# Altium schematic sheet USBDM_SWD_SER_JS16CWJ.SchDoc: USBDM_JS16CWJ_V2
size A4; Revision: 3.4
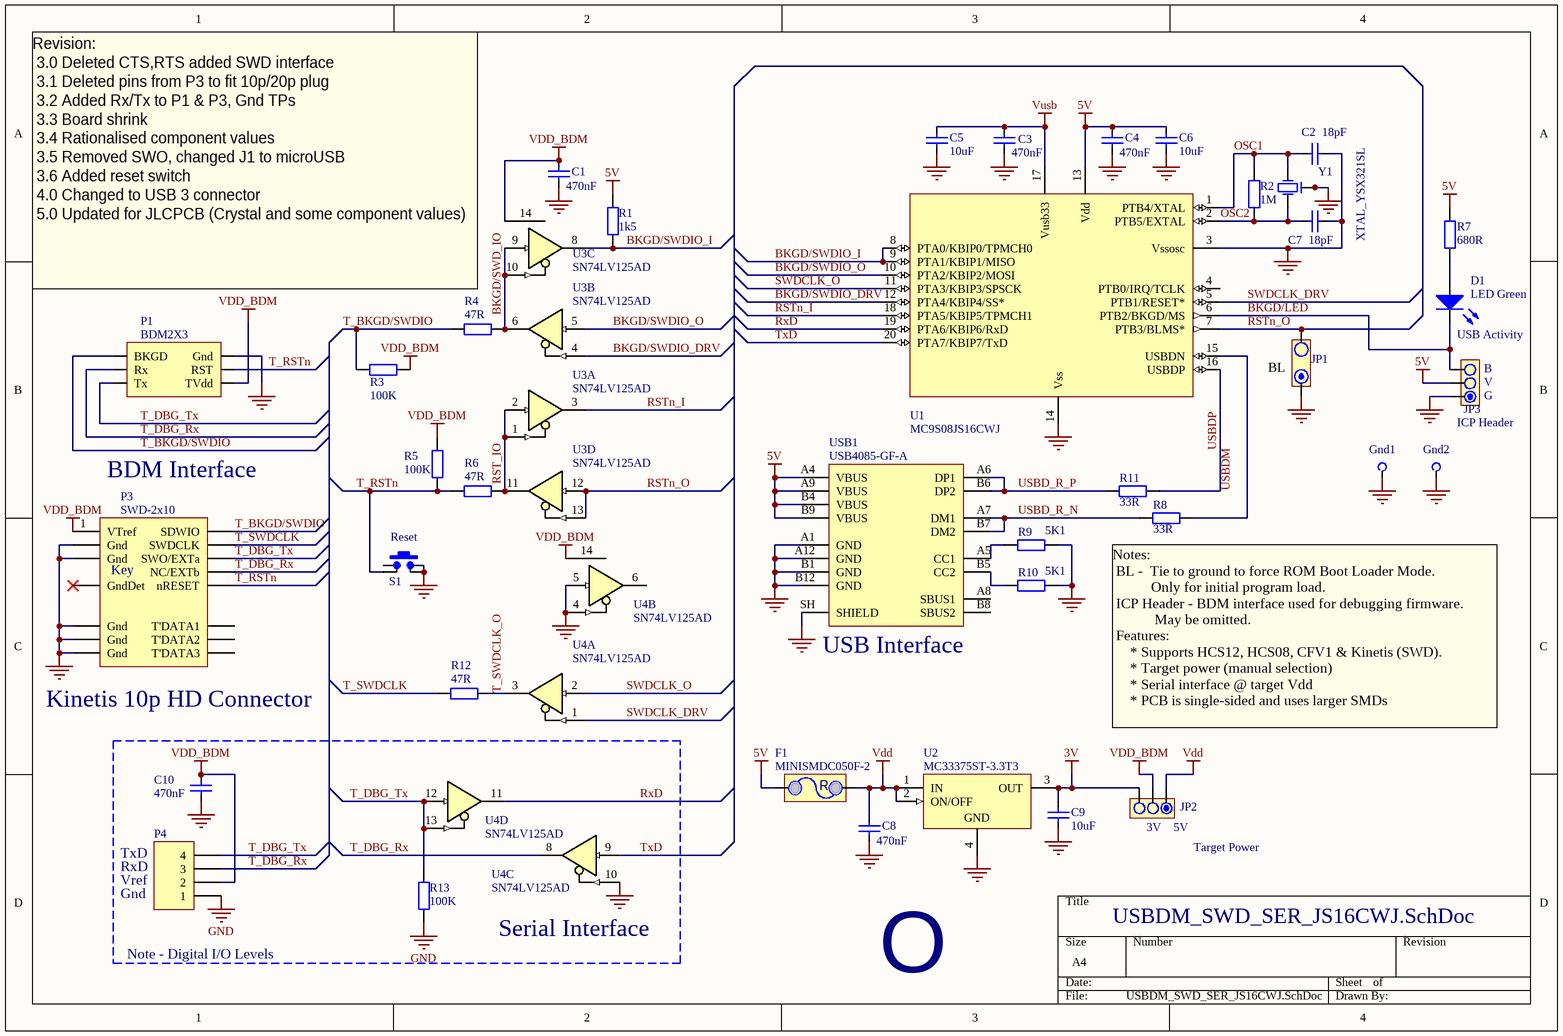
[diagram p0: USBDM_SWD_SER_JS16CWJ.SchDoc]

## Parts
C1  470nF  [CCNP2012-0805]
C2  18pF  [CCNP1608-0603_N]
C3  470nF  [CCNP2012-0805]
C4  470nF  [CCNP2012-0805]
C5  10uF  [CCNP2012-0805]
C6  10uF  [CCNP2012-0805]
C7  18pF  [CCNP1608-0603_N]
C8  470nF  [CCNP2012-0805]
C9  10uF  [CCNP2012-0805]
C10  470nF  [CCNP2012-0805]
D1  LED Green  [LED2012-0805-GREEN]
F1  MINISMDC050F-2  [PTC4532-1812]
Gnd1  TP  [PCBPIN - 0.9mm]  (value not drawn)  (no BOM)
Gnd2  TP  [PCBPIN - 0.9mm]  (value not drawn)  (no BOM)
JP1  PIN2X1  [HDR1X2S]  (value not drawn)
JP2  PIN3X1  [HDR1X3S]  (value not drawn)  (no BOM)
JP3  PIN3X1  [HDR1X3S]  (value not drawn)  (no BOM)
Logo  OSHW Logo  [OSHW]  (value not drawn)  (no BOM)
P1  BDM2X3  [BDM]
P3  SWD-2x10  [SWD-2x10 - reduced]
P4  Serial  [HDR1X4S]  (value not drawn)
R1  1k5  [CR2012-0805]
R2  1M  [CR2012-0805]
R3  100K  [CR2012-0805]
R4  47R  [CR2012-0805]
R5  100K  [CR2012-0805]
R6  47R  [CR2012-0805]
R7  680R  [CR2012-0805]
R8  33R  [CR2012-0805]
R9  5K1  [CR2012-0805]
R10  5K1  [CR2012-0805]
R11  33R  [CR2012-0805]
R12  47R  [CR2012-0805]
R13  100K  [CR2012-0805]
S1  SMD-SW-4_5.1x5.1x2.0_M  [SMD-SW-4_5.1x5.1x2.0_M]  (value not drawn)
U1  MC9S08JS16CWJ  [SO-G20]
U2  MC33375ST-3.3T3  [SOT223]
U3  SN74LV125AD  [SO-14_M]  (parts A,B,C,D of 4)
U4  SN74LV125AD  [SO-14_M]  (parts A,B,C,D of 4)
USB1  USB4085-GF-A  [USB4085-GF-A]
Y1  XTAL_YSX321SL  [Crystal_SMT - YSX321SL]

## Blocks framed on the sheet
Serial Interface: C10 P4 R13 U4

## Nets
3V: C9.2 JP2.3 U2.3(OUT)
5V: C4.2 C6.2 F1.1 JP3.2 R1.2 R7.2 U1.13(Vdd) USB1.A4(VBUS) USB1.A9(VBUS) USB1.B4(VBUS) USB1.B9(VBUS)
GND: C1.1 C2.2 C3.1 C4.1 C5.1 C6.1 C7.2 C8.1 C9.1 C10.1 Gnd1.1(TP) Gnd2.1(TP) JP1.1 JP3.1 P1.2(Gnd) P3.3(Gnd) P3.5(Gnd) P3.15(Gnd) P3.17(Gnd) P3.19(Gnd) P4.1 R9.2 R10.2 R13.2 S1.1 S1.1b U1.3(Vssosc) U1.14(Vss) U2.4(GND) U3.7(Gnd) U4.4(oe2) U4.5(a2) U4.7(Gnd) U4.10(oe3) USB1.A1(GND) USB1.A12(GND) USB1.B1(GND) USB1.B12(GND) USB1.SH(SHIELD) Y1.2(Gnd) Y1.4(Gnd)
Vdd: C8.2 F1.2 JP2.1 U2.1(IN) U2.2(ON/OFF)
VDD_BDM: C1.2 C10.2 JP2.2 P1.6(TVdd) P3.1(VTref) P4.2 R3.2 R5.1 U3.14(Vcc) U4.14(Vcc)
Vusb: C3.2 C5.2 U1.17(Vusb33)
BKGD/LED: D1.K JP3.3 U1.6(PTB2/BKGD/MS)
BKGD/SWD_IO: R4.1 U3.6(y2) U3.9(a3) U3.10(oe3)
BKGD/SWDIO_DRV: U1.12(PTA4/KBIP4/SS*) U3.4(oe2)
BKGD/SWDIO_I: R1.1 U1.8(PTA0/KBIP0/TPMCH0) U1.9(PTA1/KBIP1/MISO) U3.8(y3)
BKGD/SWDIO_O: U1.10(PTA2/KBIP2/MOSI) U3.5(a2)
OSC1: C2.1 R2.1 U1.1(PTB4/XTAL) Y1.3(OSC2)
OSC2: C7.1 R2.2 U1.2(PTB5/EXTAL) Y1.1(OSC1)
RST_IO: R6.1 U3.1(oe1) U3.2(a1) U3.11(y4)
RSTn_I: U1.18(PTA5/KBIP5/TPMCH1) U3.3(y1)
RSTn_O: JP1.2 U1.7(PTB3/BLMS*) U3.12(a4) U3.13(oe4)
RxD: U1.19(PTA6/KBIP6/RxD) U4.11(y4)
SWDCLK_DRV: U1.5(PTB1/RESET*) U4.1(oe1)
SWDCLK_O: U1.11(PTA3/KBIP3/SPSCK) U4.2(a1)
T_BKGD/SWDIO: P1.1(BKGD) P3.2(SDWIO) R3.1 R4.2
T_DBG_Rx: P1.3(Rx) P3.8(NC/EXTb) P4.3 U4.8(y3)
T_DBG_Tx: P1.5(Tx) P3.6(SWO/EXTa) P4.4 R13.1 U4.12(a4) U4.13(oe4)
T_RSTn: P1.4(RST) P3.10(nRESET) R5.2 R6.2 S1.2
T_SWDCLK: P3.4(SWDCLK) R12.2
T_SWDCLK_O: R12.1 U4.3(y1)
TxD: U1.20(PTA7/KBIP7/TxD) U4.9(a3)
USBD_R_N: R8.1 USB1.A7(DM1) USB1.B7(DM2)
USBD_R_P: R11.1 USB1.A6(DP1) USB1.B6(DP2)
USBDP: R11.2 U1.16(USBDP)
NetD1_A: D1.A R7.1
NetR8_2: R8.2 U1.15(USBDN)
NetR9_1: R9.1 USB1.A5(CC1)
NetR10_1: R10.1 USB1.B5(CC2)

Not connected (* = marked no-connect by the designer): P3 9(GndDet)* 16(T'DATA1) 18(T'DATA2) 20(T'DATA3); S1 2b; U1 4(PTB0/IRQ/TCLK); U4 6(y2); USB1 A8(SBUS1) B8(SBUS2)

## Notes on the sheet
- Revision:
  3.0 Deleted CTS,RTS added SWD interface
  3.1 Deleted pins from P3 to fit 10p/20p plug
  3.2 Added Rx/Tx to P1 & P3, Gnd TPs
  3.3 Board shrink
  3.4 Rationalised component values
  3.5 Removed SWO, changed J1 to microUSB
  3.6 Added reset switch
  4.0 Changed to USB 3 connector
  5.0 Updated for JLCPCB (Crystal and some component values)
- (near JP1) BL
- USB Activity
- (near JP3) V
- (near JP3) B
- (near JP3) ICP Header
- (near JP3) G
- BDM Interface
- (near S1) Reset
- (near USB1) USB Interface
- (near P3) Kinetis 10p HD Connector
- (near R8) Notes:
  BL -  Tie to ground to force ROM Boot Loader Mode.
  Only for initial program load.
  ICP Header - BDM interface used for debugging firmware.
  May be omitted.
  Features:
  * Supports HCS12, HCS08, CFV1 & Kinetis (SWD).
  * Target power (manual selection)
  * Serial interface @ target Vdd
  * PCB is single-sided and uses larger SMDs
- (near JP2) 3V
- (near JP2) 5V
- (near JP2) Target Power
- (near P4) Vref
- TxD
- (near P4) RxD
- (near P4) Gnd
- (near P4) Note - Digital I/O Levels
- Labels drawn without touching a wire or pin: USBDM
- (in symbol MINISMDC050F-2) R
- (in symbol OSHW Logo) O
- (in symbol SWD2X10-Reduced) Key

## Library data of the parts
C1 C3 C4 C8 C10 = Cap: Capacitor SMT 0805; Manufacturer: Generic Components; Class: Passive; Published: 08/06/2000; Publisher: Altium Hobart Technology Centre; SubClass: Capacitor; Value: 470nF; Farnell PN: 2497003; Digikey: *
C2 C7 = Cap_CCNP_0603_18pF: 50V 1nF X7R ±10% 0603 MLCC; Manufacturer: Generic Components; Class: Passive; SubClass: Capacitor; Published: 08/06/2000; Publisher: Altium Hobart Technology Centre; Farnell PN: *; Digikey: *; LCSC: C1647; Value: 18pF
C5 C6 C9 = Cap_CCNP_0805_10uF/25V: 25V 10uF X5R ±10% 0805 MLCC; Manufacturer: Generic Components; Class: Passive; SubClass: Capacitor; Published: 08/06/2000; Publisher: Altium Hobart Technology Centre; Farnell PN: *; Digikey: *; LCSC: C15850; Value: 10uF
D1 = LED-0805-Green: LED 0805 Green; Manufacturer: Generic Components; Class I: Optoelectronic; Published: 8-Jun-2000; Revision: July-2002: Re-released for DXP Platform.; Publisher: Altium Limited; Class II: LED; Farnell PN: 5790852; Digikey: *
F1 = MINISMDC050F-2: PolySwitch miniSMDC Series, 500 mA, 1 A, 24 VDC; Digikey: *; Farnell PN: 1175839
Gnd1 Gnd2 = TP: Test Point; Digikey: *; Farnell PN: *
P3 = SWD2X10-Reduced: SWD Connector 2x10-Pin; LatestRevisionDate: 17-Jul-2002; LatestRevisionNote: Re-released for DXP Platform.; Publisher: Altium Limited
P4 = Header 4: Header, 4-Pin; LatestRevisionDate: 17-Jul-2002; LatestRevisionNote: Re-released for DXP Platform.; Publisher: Altium Limited
R1-R13 = Res: Resistor SMT; Manufacturer: Generic Components; Class: Passive; Published: 08/06/2000; Publisher: Altium Hobart Technology Centre; SubClass: Resistor
  R1: Value: 1k5; Farnell PN: 1632464; Digikey: *
  R2: Value: 1M; Farnell PN: 9236392; Digikey: *
  R3: Value: 100K; Farnell PN: 9332405; Digikey: *
  R4 R6 R12: Value: 47R; Farnell PN: 1632490; Digikey: *
  R5: Value: 100K
  R7: Value: 680R; Farnell PN: 9334785; Digikey: *
  R8 R11: Value: 33R; Farnell PN: 1631399; Digikey: *
  R9 R10: Value: 5K1; Farnell PN: 1631399; Digikey: *
  R13: Value: 100K; Farnell PN: 1638463
S1 = SW_PB-TS: Tactile Switch SPST 5.10mm X 5.10mm / (1.5mm=C318884) / (2.0mm=C318888) / (3.5mm=C318886); Revision: 1.0; LCSC: C318888
U1 = MC9S08JS16CWJ: Microcontroller with USB; Farnell PN: 1704517; Digikey: *
U2 = MC33375ST-3.3T3: Low Dropout 300mA Voltage Regulator with ON/OFF Control; Published: 15-Apr-2002; DatasheetVersion: Mar-2000; PackageVersion: Nov-1999; PackageReference: 318E-04; Publisher: Altium Limited; PackageDescription: SOT-223/SC-73; 4 Leads; Body 6.7 x 7.3 mm, inc. leads (LxW max); ComponentLink1Description: Manufacturer Link; ComponentLink1URL: http://www.onsemi.com/site/products/taxonomy/0,4438,503,00.html; ComponentLink2Description: Datasheet; ComponentLink2URL: http://www.onsemi.com/pub/Collateral/MC33375-D.PDF; Farnell PN: 1150444
U3 U4 = SN74LV125AD: Quad 3-state Buffer (5V Tolerant); Digikey: *; Farnell PN: 9592504; Supplier 1: Digi-Key; Supplier Part Number 1: 296-1674-5-ND
USB1 = USB4085-GF-A: USB-C, USB 2.0 Receptacle Connector 16 Position Through Hole, Right Angle; Angle: 90; Part Number: USB4085-GF-A; Digikey Part Number: 2073-USB4085-GF-ACT-ND; Digikey Link: https://www.digikey.ee/product-detail/en/gct/USB4085-GF-A/2073-USB4085-GF-ACT-ND/9859733; Farnell PN: 2924867; Digikey: 2073-USB4085-GF-ACT-ND; LCSC: *
Y1 = XTAL_YSX321SL: Crystal (YXC YSX321SL 12 MHZ 12.0PF); Manufacturer: Generic Components; Class: Oscillator; SubClass: Crystal Oscillator; Published: 08/06/2000; Publisher: Altium Hobart Technology Centre; Digikey: *; Farnell PN: 1712815; LCSC: C9002
JP1 = PIN2X1: Digikey: *; Farnell PN: *
JP2 JP3 = PIN3X1: Digikey: *